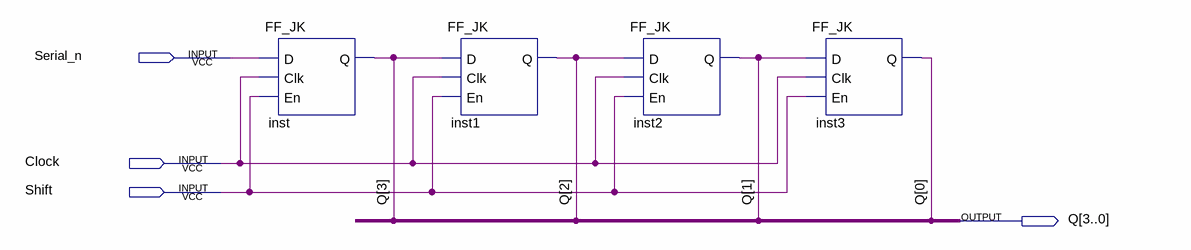
[diagram p0: schematic sheet]
// Quartus schematic Shift_Register.bdf as structural Verilog: 4 symbols, 4 pins
module Shift_Register (
  input  Serial_n,
  input  Clock,
  input  Shift,
  output [3:0] Q
);

  FF_JK inst (.D(Serial_n), .Clk(Clock), .En(Shift), .Q(Q[3]));
  FF_JK inst1 (.D(Q[3]), .Clk(Clock), .En(Shift), .Q(Q[2]));
  FF_JK inst2 (.D(Q[2]), .Clk(Clock), .En(Shift), .Q(Q[1]));
  FF_JK inst3 (.D(Q[1]), .Clk(Clock), .En(Shift), .Q(Q[0]));
endmodule
